# EAGLE schematic mod.main (EAGLE 7.1.0)
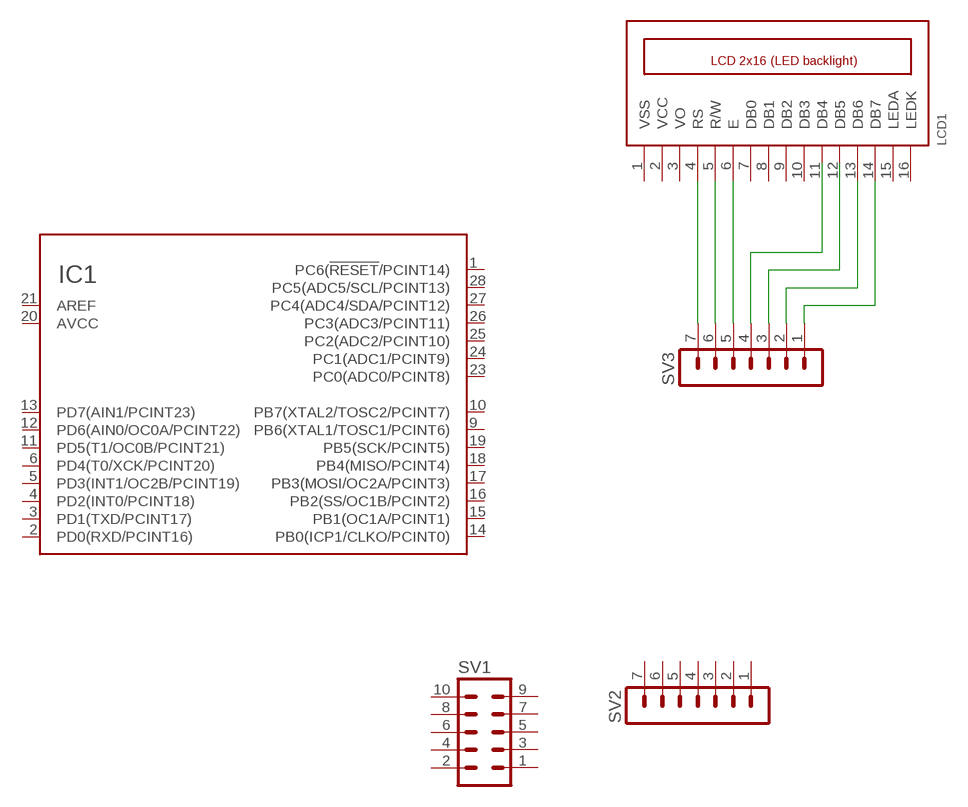
[diagram p0: schematic, sheet 1]

## Parts
IC1  ATMEGA48/88/168/328-PU(DIP28)PU  [DIL28]
LCD1  LCD_2X16_SIL  [HY-1602F]
SV1  MA05-2  [MA05-2]
SV2  MA07-1  [MA07-1]
SV3  MA07-1  [MA07-1]

## Nets
N$1: LCD1.14(DB7) SV3.1
N$2: LCD1.13(DB6) SV3.2
N$3: SV3.3
N$4: SV3.4
N$5: LCD1.6(E) SV3.5
N$6: LCD1.5(R/W) SV3.6
N$7: LCD1.4(RS) SV3.7
Unconnected: IC1.1(PC6(!RESET!/PCINT14)) IC1.2(PD0(RXD/PCINT16)) IC1.3(PD1(TXD/PCINT17)) IC1.4(PD2(INT0/PCINT18)) IC1.5(PD3(INT1/OC2B/PCINT19)) IC1.6(PD4(T0/XCK/PCINT20)) IC1.9(PB6(XTAL1/TOSC1/PCINT6)) IC1.10(PB7(XTAL2/TOSC2/PCINT7)) IC1.11(PD5(T1/OC0B/PCINT21)) IC1.12(PD6(AIN0/OC0A/PCINT22)) IC1.13(PD7(AIN1/PCINT23)) IC1.14(PB0(ICP1/CLKO/PCINT0)) IC1.15(PB1(OC1A/PCINT1)) IC1.16(PB2(SS/OC1B/PCINT2)) IC1.17(PB3(MOSI/OC2A/PCINT3)) IC1.18(PB4(MISO/PCINT4)) IC1.19(PB5(SCK/PCINT5)) IC1.21(AREF) IC1.23(PC0(ADC0/PCINT8)) IC1.24(PC1(ADC1/PCINT9)) IC1.25(PC2(ADC2/PCINT10)) IC1.26(PC3(ADC3/PCINT11)) IC1.27(PC4(ADC4/SDA/PCINT12)) IC1.28(PC5(ADC5/SCL/PCINT13)) LCD1.3(VO) LCD1.7(DB0) LCD1.8(DB1) LCD1.9(DB2) LCD1.10(DB3) LCD1.11(DB4) LCD1.12(DB5) LCD1.15(LEDA) LCD1.16(LEDK) SV1.1 SV1.2 SV1.3 SV1.4 SV1.5 SV1.6 SV1.7 SV1.8 SV1.9 SV1.10 SV2.1 SV2.2 SV2.3 SV2.4 SV2.5 SV2.6 SV2.7

## Power pins joined to a net without a drawn wire
AVCC: IC1.20(AVCC)
GND: IC1.8(GND) IC1.22(GND)
UCC: IC1.7(UCC)
VCC: LCD1.2(VCC)
VSS: LCD1.1(VSS)

## Library data of the parts
IC1 = atmel_tiny24-44-84tiny48-88mega48-88-168-328:ATMEGA48/88/168/328-PU(DIP28)
LCD1 = lcd_2x16_led_backlight:LCD_2X16_SIL
SV1 = con-lstb:MA05-2: PIN HEADER; OC_FARNELL: unknown; OC_NEWARK: unknown
SV2 SV3 = con-lstb:MA07-1: PIN HEADER; OC_FARNELL: unknown; OC_NEWARK: unknown